# EAGLE schematic Keyboard_ribbon_connection (EAGLE 9.6.2)
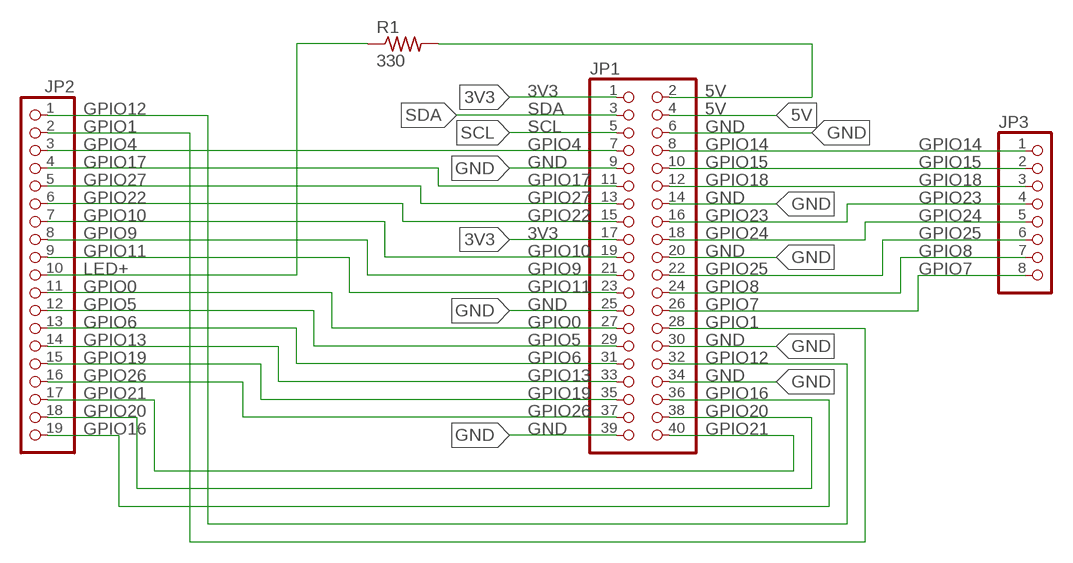
[diagram p0: schematic, sheet 1]

## Parts
JP1  PINHD-2X20  [2X20]
JP2  PINHD-1X19  [1X19]
JP3  PINHD-1X8  [1X08]
R1  330  R-US_0207/10  [0207/10]

## Nets
3V3: JP1.1 JP1.17
5V: JP1.2 JP1.4 R1.2
GND: JP1.6 JP1.9 JP1.14 JP1.20 JP1.25 JP1.30 JP1.34 JP1.39
GPIO0: JP1.27 JP2.11
GPIO1: JP1.28 JP2.2
GPIO4: JP1.7 JP2.3
GPIO5: JP1.29 JP2.12
GPIO6: JP1.31 JP2.13
GPIO7: JP1.26 JP3.8
GPIO8: JP1.24 JP3.7
GPIO9: JP1.21 JP2.8
GPIO10: JP1.19 JP2.7
GPIO11: JP1.23 JP2.9
GPIO12: JP1.32 JP2.1
GPIO13: JP1.33 JP2.14
GPIO14: JP1.8 JP3.1
GPIO15: JP1.10 JP3.2
GPIO16: JP1.36 JP2.19
GPIO17: JP1.11 JP2.4
GPIO18: JP1.12 JP3.3
GPIO19: JP1.35 JP2.15
GPIO20: JP1.38 JP2.18
GPIO21: JP1.40 JP2.17
GPIO22: JP1.15 JP2.6
GPIO23: JP1.16 JP3.4
GPIO24: JP1.18 JP3.5
GPIO25: JP1.22 JP3.6
GPIO26: JP1.37 JP2.16
GPIO27: JP1.13 JP2.5
LED+: JP2.10 R1.1
SCL: JP1.5
SDA: JP1.3

## Library data of the parts
JP1 = pinhead:PINHD-2X20: PIN HEADER
JP2 = pinhead:PINHD-1X19: PIN HEADER
JP3 = pinhead:PINHD-1X8: PIN HEADER
R1 = rcl:R-US_: RESISTOR, American symbol; SPICEPREFIX: R